# EAGLE design p2c-001 (EAGLE 9.6.2)
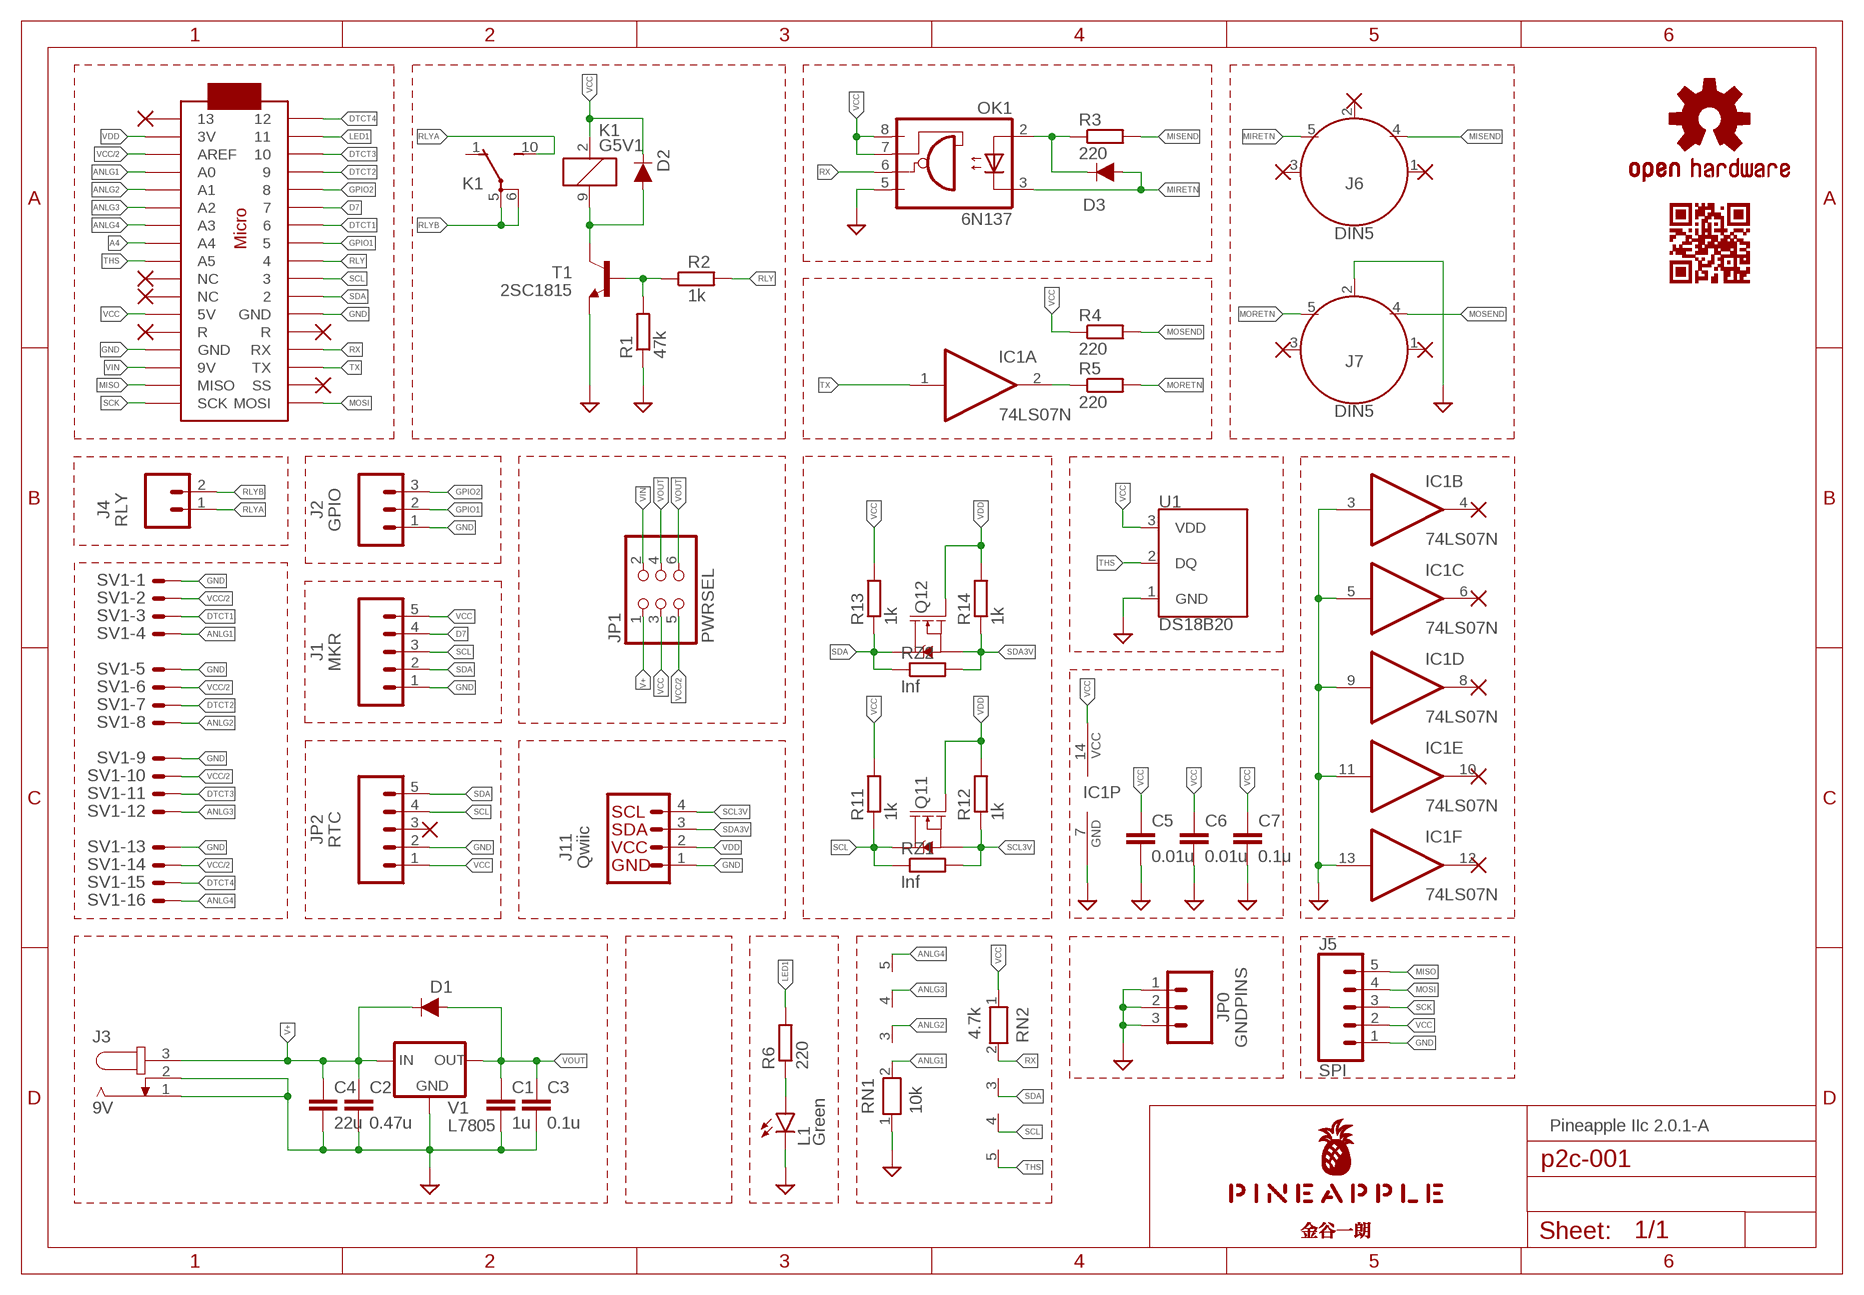
[diagram p0: schematic, sheet 1]

## Parts
C1  1u  C-EU050-024X044  [C050-024X044]
C2  0.47u  C-EU050-024X044  [C050-024X044]
C3  0.1u  C-EU025-024X044  [C025-024X044]
C4  22u  C-EU025-050X050  [C025-050X050]
C5  0.01u  C-EU025-024X044  [C025-024X044]
C6  0.01u  C-EU025-024X044  [C025-024X044]
C7  0.1u  C-EU025-024X044  [C025-024X044]
D1  DIODE-1N4148  [DIODE-1N4148]
D2  DIODE-1N4148  [DIODE-1N4148]
D3  DIODE-1N4148  [DIODE-1N4148]
IC1  74LS07N  [DIL14]
J1  MKR  CONN_05JST  [JST-5-PTH]
J2  GPIO  CONN_03JST-PTH  [JST-3-PTH]
J3  9V  JACK-PLUG0  [SPC4077]
J4  RLY  CONN_02JST-PTH-2  [JST-2-PTH]
J5  SPI  CONN_05JST-VERT  [JST-5-PTH-VERT]
J6  DIN5  [DIN5-RA-PTH]
J7  DIN5  [DIN5-RA-PTH]
J11  Qwiic  QWIIC_CONNECTORJS-1MM  [1X04_1MM_RA]
JP0  GNDPINS  CONN_03  [1X03]
JP1  PWRSEL  PINHD-2X3  [2X03]
JP2  RTC  CONN_05  [1X05]
K1  G5V1  [G5V1]
L1  Green  LED3MM  [LED3MM]
LOGO1  OSHW-LOGOS-COPPER  [OSHW-LOGO-S_COPPER]
OK1  6N137  [DIL08]
Q11  220mA/50V/3.5Ω  MOSFET-NCH-BSS138  [SOT23-3]
Q12  220mA/50V/3.5Ω  MOSFET-NCH-BSS138  [SOT23-3]
R1  47k  R-EU_0204/5  [0204/5]
R2  1k  R-EU_0204/5  [0204/5]
R3  220  R-EU_0204/5  [0204/5]
R4  220  R-EU_0204/5  [0204/5]
R5  220  R-EU_0204/5  [0204/5]
R6  220  R-EU_0204/5  [0204/5]
R11  1k  R-EU_R2012  [R2012]
R12  1k  R-EU_R2012  [R2012]
R13  1k  R-EU_R2012  [R2012]
R14  1k  R-EU_R2012  [R2012]
RN1  10k  RN04  [RN-5]
RN2  4.7k  RN04  [RN-5]
RZ1  Inf  R-EU_R2012  [R2012]
RZ2  Inf  R-EU_R2012  [R2012]
SV1  ML16LE  [ML16L]
T1  2SC1815  [TO92-ECB]
U1  DS18B20  [TO-92-AMMO]
U$1  PINEAPPLE450_SILK  [PINEAPPLE450_SILK]
U$2  ARDUINOMICRO  [ARDUINOMICRO]
U$3  KANAYA768_SILK  [KANAYA768_SILK]
U$4  CARDQRCODE450_SILK  [CARDQRCODE450_SILK]
V1  L7805  78XXS  [78XXS]

## Nets
A4: U$2.P$27(A4)
ANLG1: RN1.2 SV1.4 U$2.P$31(A0)
ANLG2: RN1.3 SV1.8 U$2.P$30(A1)
ANLG3: RN1.4 SV1.12 U$2.P$29(A2)
ANLG4: RN1.5 SV1.16 U$2.P$28(A3)
D7: J1.4 U$2.P$6
DTCT1: SV1.3 U$2.P$7
DTCT2: SV1.7 U$2.P$4
DTCT3: SV1.11 U$2.P$3
DTCT4: SV1.15 U$2.P$1
GND [ground]: C1.2 C2.2 C3.2 C4.2 C5.2 C6.2 C7.2 IC1.3(B:I) IC1.5(C:I) IC1.7(P:GND) IC1.9(D:I) IC1.11(E:I) IC1.13(F:I) J1.1 J2.1 J3.1 J3.2 J5.1 J7.2 J11.1(GND) JP0.1 JP0.2 JP0.3 JP2.2 L1.K(C) OK1.5(GND) R1.1 RN1.1 SV1.1 SV1.5 SV1.9 SV1.13 T1.E U1.1(GND) U$2.P$12(GND) U$2.P$21(GND) V1.GND
GPIO1: J2.2 U$2.P$8
GPIO2: J2.3 U$2.P$5
LED1: R6.2 U$2.P$2
LED1A: L1.A R6.1
MIA: D3.C OK1.2(A) R3.1
MIRETN: D3.A J6.5 OK1.3(C)
MISEND: J6.4 R3.2
MISO: J5.5 U$2.P$19(MISO)
MOC: IC1.2(A:O) R5.1
MORETN: J7.5 R5.2
MOSEND: J7.4 R4.2
MOSI: J5.4 U$2.P$17(MOSI)
RLY: R2.2 U$2.P$9
RLYA: J4.1 K1.10(2:S)
RLYB: J4.2 K1.5(2:P) K1.6(2:P)
RLYC: D2.A K1.9 T1.C
RLYQ: R1.2 R2.1 T1.B
RX: OK1.6(VO) RN2.2 U$2.P$14(RX)
SCK: J5.3 U$2.P$18(SCK)
SCL: J1.3 JP2.4 Q11.3(D) R11.1 RN2.4 RZ1.1 U$2.P$10
SCL3V: J11.4(SCL) Q11.2(S) R12.1 RZ1.2
SDA: J1.2 JP2.5 Q12.3(D) R13.1 RN2.3 RZ2.1 U$2.P$11
SDA3V: J11.3(SDA) Q12.2(S) R14.1 RZ2.2
THS: RN2.5 U1.2(DQ) U$2.P$26(A5)
TX: IC1.1(A:I) U$2.P$15(TX)
V+ [power1]: C2.1 C4.1 D1.C J3.3 JP1.1 V1.IN
VCC [power1]: C5.1 C6.1 C7.1 D2.C IC1.14(P:VCC) J1.5 J5.2 JP1.3 JP2.1 K1.2 OK1.7(VE) OK1.8(VCC) R4.1 R11.2 R13.2 RN2.1 U1.3(VDD) U$2.P$23(5V)
VCC/2 [power1]: JP1.5 SV1.2 SV1.6 SV1.10 SV1.14 U$2.P$32(AREF)
VDD [power2]: J11.2(VCC) Q11.1(G) Q12.1(G) R12.2 R14.2 U$2.P$33(3V)
VIN [power1]: JP1.2 U$2.P$20(9V)
VOUT [power1]: C1.1 C3.1 D1.A JP1.4 JP1.6 V1.OUT
Unconnected: IC1.4(B:O) IC1.6(C:O) IC1.8(D:O) IC1.10(E:O) IC1.12(F:O) J6.1 J6.2 J6.3 J7.1 J7.3 JP2.3 K1.1(2:O) U$2.P$13(R) U$2.P$16(SS) U$2.P$22(R) U$2.P$24(NC) U$2.P$25(NC) U$2.P$34

## Notes on the sheet
- Pineapple IIc 2.0.1-A

## Library data of the parts
C1-C4 C7 = rcl:C-EU: CAPACITOR, European symbol; SPICEPREFIX: C
C5 C6 = resistor:C-EU: CAPACITOR, European symbol
D1-D3 = SparkFun-DiscreteSemi:DIODE: Diode These are standard reverse protection diodes and small signal diodes. SparkFun Products: SparkFun SparkPunk Sound Kit <https://www.sparkfun.com/products/11177> SparkFun ESP8266 Thing <https://www.sparkfun.com/products/13231>; PROD_ID: DIO-08378; VALUE: 200mA/100V/1V
IC1 = 74xx-us:74*07: Hex BUFFER, open collector high-voltage output
J1 = SparkFun-Connectors:CONN_05: Multi connection point. Often used as Generic Header-pin footprint for 0.1 inch spaced/style header connections On any of the 0.1 inch spaced packages, you can populate with these: Break Away Headers - Straight <https://www.sparkfun.com/products/116> (PRT-00116) Break Away Male Headers - Right Angle <https://www.sparkfun.com/products/553> (PRT-00553) Female Headers <https://www.sparkfun.com/products/115> (PRT-00115) Break Away Headers - Machine Pin <https://www.sparkfun.com/products/117> (PRT-00117) Break Away Female Headers - Swiss Machine Pin <https://www.sparkfun.com/products/743> (PRT-00743) For SCREWTERMINALS and SPRING TERMINALS visit here: Screw Terimnals on SparkFun.com <https://www.sparkfun.com/search/results?term=Screw+Terminals> (5mm/3.5mm/2.54mm spacing) This device is also useful as a general connection point to wire up your design to another part of your project. Our various solder wires solder well into these plated through hole pads. Hook-Up Wire - Assortment (Stranded, 22 AWG) <https://www.sparkfun.com/products/11375> (PRT-11375) Hook-Up Wire - Assortment (Solid Core, 22 AWG) <https://www.sparkfun.com/products/11367> (PRT-11367) View the entire wire category on our website here <https://www.sparkfun.com/categories/141> Special notes: Molex polarized connector foot print use with SKU : PRT-08231 with associated crimp pins and housings. 1MM SMD Version SKU: PRT-10208; SF_ID: PRT-09917
J2 = SparkFun-Connectors:CONN_03: Multi connection point. Often used as Generic Header-pin footprint for 0.1 inch spaced/style header connections On any of the 0.1 inch spaced packages, you can populate with these: Break Away Headers - Straight <https://www.sparkfun.com/products/116> (PRT-00116) Break Away Male Headers - Right Angle <https://www.sparkfun.com/products/553> (PRT-00553) Female Headers <https://www.sparkfun.com/products/115> (PRT-00115) Break Away Headers - Machine Pin <https://www.sparkfun.com/products/117> (PRT-00117) Break Away Female Headers - Swiss Machine Pin <https://www.sparkfun.com/products/743> (PRT-00743) Stackable Header - 3 Pin (Female, 0.1") <https://www.sparkfun.com/products/13875> (PRT-13875) For SCREWTERMINALS and SPRING TERMINALS visit here: Screw Terimnals on SparkFun.com <https://www.sparkfun.com/search/results?term=Screw+Terminals> (5mm/3.5mm/2.54mm spacing) This device is also useful as a general connection point to wire up your design to another part of your project. Our various solder wires solder well into these plated through hole pads. Hook-Up Wire - Assortment (Stranded, 22 AWG) <https://www.sparkfun.com/products/11375> (PRT-11375) Hook-Up Wire - Assortment (Solid Core, 22 AWG) <https://www.sparkfun.com/products/11367> (PRT-11367) View the entire wire category on our website here <https://www.sparkfun.com/categories/141> Special notes: Molex polarized connector foot print use with SKU : PRT-08232 with associated crimp pins and housings.; PROD_ID: WIRE-10037; SF_ID: PRT-09915
J3 = con-jack:JACK-PLUG: DC POWER JACK Power Jack, DC, Right Angle, Through Hole, Rated 5A at 16VDC, PC Terminals Distributor: Farnell (www.Farnell.de) Drawing: 84N1161.pdf / 84N1162.pdf Manufacturer: SPC Technology (www.spctechnology.com) Type: SPC4077 / SPC 4078; OC_FARNELL: unknown; OC_NEWARK: unknown
J4 = SparkFun-Connectors:CONN_02: Multi connection point. Often used as Generic Header-pin footprint for 0.1 inch spaced/style header connections On any of the 0.1 inch spaced packages, you can populate with these: Break Away Headers - Straight <https://www.sparkfun.com/products/116> (PRT-00116) Break Away Male Headers - Right Angle <https://www.sparkfun.com/products/553> (PRT-00553) Female Headers <https://www.sparkfun.com/products/115> (PRT-00115) Break Away Headers - Machine Pin <https://www.sparkfun.com/products/117> (PRT-00117) Break Away Female Headers - Swiss Machine Pin <https://www.sparkfun.com/products/743> (PRT-00743) For SCREWTERMINALS and SPRING TERMINALS visit here: Screw Terimnals on SparkFun.com <https://www.sparkfun.com/search/results?term=Screw+Terminals> (5mm/3.5mm/2.54mm spacing) This device is also useful as a general connection point to wire up your design to another part of your project. Our various solder wires solder well into these plated through hole pads. Hook-Up Wire - Assortment (Stranded, 22 AWG) <https://www.sparkfun.com/products/11375> (PRT-11375) Hook-Up Wire - Assortment (Solid Core, 22 AWG) <https://www.sparkfun.com/products/11367> (PRT-11367) View the entire wire category on our website here <https://www.sparkfun.com/categories/141> Special notes: Molex polarized connector foot print use with: PRT-08233 with associated crimp pins and housings. 2.54_SCREWTERM for use with PRT-10571. 3.5mm Screw Terminal footprints for PRT-08084 5mm Screw Terminal footprints for use with PRT-08432; PROD_ID: CONN-09863; SKU: PRT-09914
J5 JP2 = SparkFun-Connectors:CONN_05: Multi connection point. Often used as Generic Header-pin footprint for 0.1 inch spaced/style header connections On any of the 0.1 inch spaced packages, you can populate with these: Break Away Headers - Straight <https://www.sparkfun.com/products/116> (PRT-00116) Break Away Male Headers - Right Angle <https://www.sparkfun.com/products/553> (PRT-00553) Female Headers <https://www.sparkfun.com/products/115> (PRT-00115) Break Away Headers - Machine Pin <https://www.sparkfun.com/products/117> (PRT-00117) Break Away Female Headers - Swiss Machine Pin <https://www.sparkfun.com/products/743> (PRT-00743) For SCREWTERMINALS and SPRING TERMINALS visit here: Screw Terimnals on SparkFun.com <https://www.sparkfun.com/search/results?term=Screw+Terminals> (5mm/3.5mm/2.54mm spacing) This device is also useful as a general connection point to wire up your design to another part of your project. Our various solder wires solder well into these plated through hole pads. Hook-Up Wire - Assortment (Stranded, 22 AWG) <https://www.sparkfun.com/products/11375> (PRT-11375) Hook-Up Wire - Assortment (Solid Core, 22 AWG) <https://www.sparkfun.com/products/11367> (PRT-11367) View the entire wire category on our website here <https://www.sparkfun.com/categories/141> Special notes: Molex polarized connector foot print use with SKU : PRT-08231 with associated crimp pins and housings. 1MM SMD Version SKU: PRT-10208
J6 J7 = SparkFun-Connectors:DIN5: DIN5 Connector - Female Right Angle (frequently used as a MIDI Jack connector) This type of connector and cable is frequently used for transmitting midi data (musical instrument digital interface). It is what you usually see on a keyboard or set of electronic drums. Learn more here <https://en.wikipedia.org/wiki/MIDI>. For more information on the pinout and electrical specifications of MIDI communications, please see the following resource: https://www.midi.org/specifications/item/midi-din-electrical-specification Here is the connector we sell at SparkFun: MIDI Connector - Female Right Angle <https://www.sparkfun.com/products/9536> (PRT-09536) Datasheet <hhttp://www.sparkfun.com/datasheets/Prototyping/Connectors/MIDI-RA.pdf> It is used on this SparkFun product: SparkFun MIDI Shield <https://www.sparkfun.com/products/12898> (DEV-12898); PROD_ID: CONN-09481
J11 = SparkFun-Connectors:QWIIC_CONNECTOR: SparkFun I2C Standard Qwiic Connector An SMD 1mm pitch JST connector makes it easy and quick (get it? Qwiic?) to connect I2C devices to each other. The Qwiic system <http://www.sparkfun.com/qwiic> enables fast and solderless connection between popular platforms and various sensors and actuators. We carry 200mm <https://www.sparkfun.com/products/14204>, 100mm <https://www.sparkfun.com/products/14205>, 50mm <https://www.sparkfun.com/products/14206>, and breadboard friendly <https://www.sparkfun.com/products/14207> Qwiic cables. We also offer 10 pcs strips <https://www.sparkfun.com/products/14323> the SMD connectors.
JP0 = SparkFun-Connectors:CONN_03: Multi connection point. Often used as Generic Header-pin footprint for 0.1 inch spaced/style header connections On any of the 0.1 inch spaced packages, you can populate with these: Break Away Headers - Straight <https://www.sparkfun.com/products/116> (PRT-00116) Break Away Male Headers - Right Angle <https://www.sparkfun.com/products/553> (PRT-00553) Female Headers <https://www.sparkfun.com/products/115> (PRT-00115) Break Away Headers - Machine Pin <https://www.sparkfun.com/products/117> (PRT-00117) Break Away Female Headers - Swiss Machine Pin <https://www.sparkfun.com/products/743> (PRT-00743) Stackable Header - 3 Pin (Female, 0.1") <https://www.sparkfun.com/products/13875> (PRT-13875) For SCREWTERMINALS and SPRING TERMINALS visit here: Screw Terimnals on SparkFun.com <https://www.sparkfun.com/search/results?term=Screw+Terminals> (5mm/3.5mm/2.54mm spacing) This device is also useful as a general connection point to wire up your design to another part of your project. Our various solder wires solder well into these plated through hole pads. Hook-Up Wire - Assortment (Stranded, 22 AWG) <https://www.sparkfun.com/products/11375> (PRT-11375) Hook-Up Wire - Assortment (Solid Core, 22 AWG) <https://www.sparkfun.com/products/11367> (PRT-11367) View the entire wire category on our website here <https://www.sparkfun.com/categories/141> Special notes: Molex polarized connector foot print use with SKU : PRT-08232 with associated crimp pins and housings.
JP1 = pinhead:PINHD-2X3: PIN HEADER
K1 = relay:G5V1: RELAY 1 x switch, 0.5 A/125 V AC, 1 A/24 V DC , Omron; MPN: G5V-1-DC24; OC_FARNELL: 9949593; OC_NEWARK: 36M6377
L1 = led:LED: LED OSRAM: - CHIPLED LG R971, LG N971, LY N971, LG Q971, LY Q971, LO R971, LY R971 LH N974, LH R974 LS Q976, LO Q976, LY Q976 LO Q996 - Hyper CHIPLED LW Q18S LB Q993, LB Q99A, LB R99A - SideLED LS A670, LO A670, LY A670, LG A670, LP A670 LB A673, LV A673, LT A673, LW A673 LH A674 LY A675 LS A676, LA A676, LO A676, LY A676, LW A676 LS A679, LY A679, LG A679 - Hyper Micro SIDELED® LS Y876, LA Y876, LO Y876, LY Y876 LT Y87S - SmartLED LW L88C, LW L88S LB L89C, LB L89S, LG L890 LS L89K, LO L89K, LY L89K LS L896, LA L896, LO L896, LY L896 - TOPLED LS T670, LO T670, LY T670, LG T670, LP T670 LSG T670, LSP T670, LSY T670, LOP T670, LYG T670 LG T671, LOG T671, LSG T671 LB T673, LV T673, LT T673, LW T673 LH T674 LS T676, LA T676, LO T676, LY T676, LB T676, LH T676, LSB T676, LW T676 LB T67C, LV T67C, LT T67C, LS T67K, LO T67K, LY T67K, LW E67C LS E67B, LA E67B, LO E67B, LY E67B, LB E67C, LV E67C, LT E67C LW T67C LS T679, LY T679, LG T679 LS T770, LO T770, LY T770, LG T770, LP T770 LB T773, LV T773, LT T773, LW T773 LH T774 LS E675, LA E675, LY E675, LS T675 LS T776, LA T776, LO T776, LY T776, LB T776 LHGB T686 LT T68C, LB T68C - Hyper Mini TOPLED® LB M676 - Mini TOPLED Santana® LG M470 LS M47K, LO M47K, LY M47K Source: http://www.osram.convergy.de LUXEON: - LUMILED® LXK2-PW12-R00, LXK2-PW12-S00, LXK2-PW14-U00, LXK2-PW14-V00 LXK2-PM12-R00, LXK2-PM12-S00, LXK2-PM14-U00 LXK2-PE12-Q00, LXK2-PE12-R00, LXK2-PE12-S00, LXK2-PE14-T00, LXK2-PE14-U00 LXK2-PB12-K00, LXK2-PB12-L00, LXK2-PB12-M00, LXK2-PB14-N00, LXK2-PB14-P00, LXK2-PB14-Q00 LXK2-PR12-L00, LXK2-PR12-M00, LXK2-PR14-Q00, LXK2-PR14-R00 LXK2-PD12-Q00, LXK2-PD12-R00, LXK2-PD12-S00 LXK2-PH12-R00, LXK2-PH12-S00 LXK2-PL12-P00, LXK2-PL12-Q00, LXK2-PL12-R00 Source: www.luxeon.com KINGBRIGHT: KA-3528ASYC Source: www.kingbright.com
LOGO1 = SparkFun-Aesthetics:OSHW-LOGO: Open-Source Hardware (OSHW) Logo This logo indicates the piece of hardware it is found on incorporates a OSHW license and/or adheres to the definition of open source hardware found here: http://freedomdefined.org/OSHW
OK1 = optocoupler:6N137: MOTOROLA OPTO COUPLER; MPN: 6N137; OC_FARNELL: 1328376; OC_NEWARK: 52M1895
Q11 Q12 = SparkFun-DiscreteSemi:MOSFET-NCH: N-channel MOSFETs Voltage controlled devices that allow control of high current outputs. SparkFun Products: SparkFun OpenScale <https://www.sparkfun.com/products/13261> SparkFun Digital Sandbox <https://www.sparkfun.com/products/12651> SparkFun Monster Moto Shield <https://www.sparkfun.com/products/10182> SparkFun MOSFET Power Controller <https://www.sparkfun.com/products/11214>; PROD_ID: TRANS-00830
R1-R6 R11-R14 RZ1 RZ2 = resistor:R-EU_: RESISTOR, European symbol
RN1 RN2 = resistor-net:RN04: RESISTOR NETWORK; OC_FARNELL: unknown; OC_NEWARK: unknown
SV1 = con-ml:ML16LE: HARTING; OC_FARNELL: unknown; OC_NEWARK: unknown
T1 = transistor:2SC1815: NPN EPITAXIAL TRANSISTOR Source: TOSHIBA .. 2SC1815 1.pdf
U1 = SparkFun-Sensors:DS18B20: Dallas/Maxim DS18B20 1-Wire Temperature Sensor The DS18B20 reports degrees C with 9 to 12-bit precision, -55C to 125C (+/-0.5C). Each sensor has a unique 64-Bit Serial number etched into it - allows for a huge number of sensors to be used on one data bus. Datasheet <http://datasheets.maximintegrated.com/en/ds/DS18B20.pdf> SparkFun Products One Wire Digital Temperature Sensor - DS18B20 <https://www.sparkfun.com/products/245> (SEN-00245); STORE_ID: SEN-00245
U$1 = pineapple:PINEAPPLE450_SILK
U$2 = adafruit:ARDUINOMICRO
U$3 = pineapple:KANAYA768_SILK
U$4 = pineapple:CARDQRCODE450_SILK
V1 = v-reg:78XXS: VOLTAGE REGULATOR

## Net classes
0 default: width 0.152 mm, drill 0.305 mm, clearance 0.152 mm
1 ground: width 0.61 mm, drill 0.305 mm, clearance 0.152 mm
2 power1: width 0.61 mm, drill 0.305 mm, clearance 0.152 mm
3 power2: width 0.305 mm, drill 0.305 mm, clearance 0.152 mm

## Board
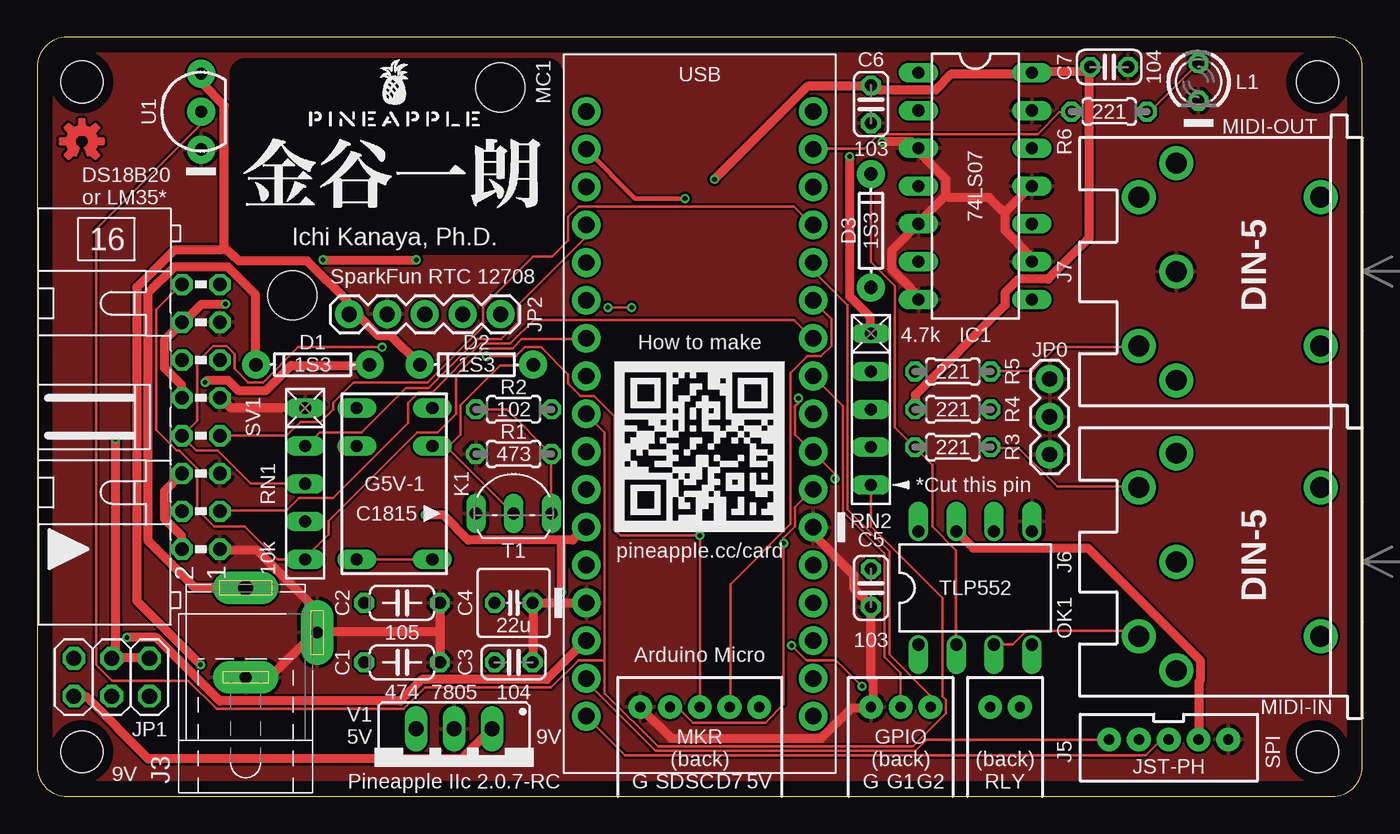
[diagram p1: board, top side]
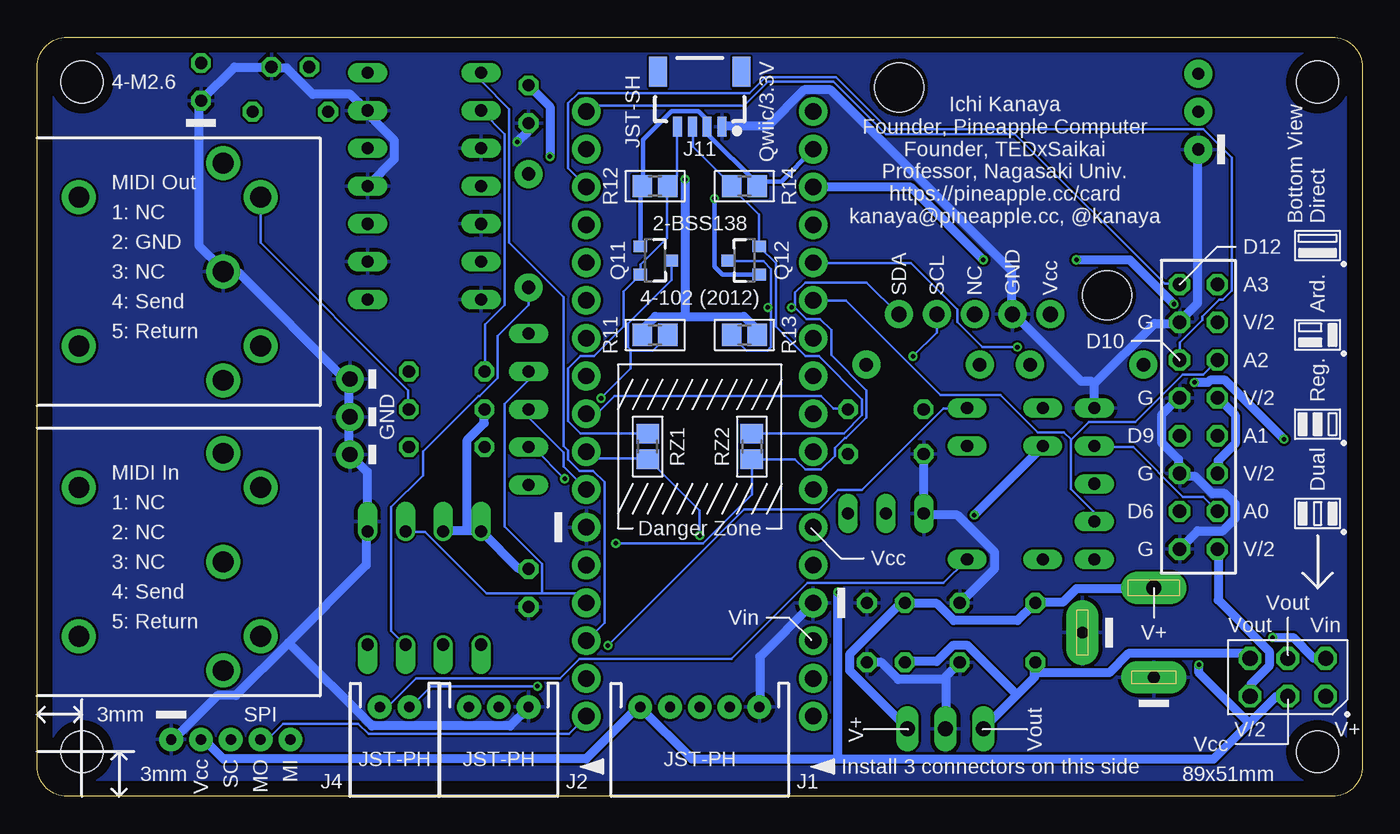
[diagram p2: board, bottom side, seen from below]

Size 89 x 51 mm. Coordinates in mm from the lower left corner, seen from the top.
Outline: 0,49 0,2 arc90 2,0 87,0 arc90 89,2 89,49 arc90 87,51 2,51 arc90 0,49
Copper layers (1*16): Top 0.035mm / dielectric 1.5mm / Bottom 0.035mm
Design rules "SeeedStudio_2layer_DRU_no_angle_20140221": minimum track width 6mil, minimum drill 12mil, track to track 6mil, track to pad 6mil, pad to pad 6mil, via to via 6mil, smd to smd 0mil, copper to edge 10mil, drill to drill 10mil, minimum pad ring 10mil, minimum via ring 6mil, stop-mask expansion 2mil, vias tented up to drill 100mil, thermal gap 10mil
Holes 2.8 mm at 3,3 3,48 86,48 86,3
tRestrict: area 0,0 to 89,1; area 88,0 to 89,51; area 0,50 to 89,51; area 0,0 to 1,51; area 1,46 to 5,50; area 1,1 to 5,5; area 84,1 to 88,5; area 84,46 to 88,50; area 13,36.5 to 35.2,49.5; area 39,18 to 50,29
bRestrict: area 0,0 to 89,1; area 88,0 to 89,51; area 0,50 to 89,51; area 0,0 to 1,51; area 84,46 to 88,50; area 84,1 to 88,5; area 1,46 to 5,50; area 1,1 to 5,5

### Footprints (pad centres in the part's own frame; a part is rotated, then mirrored left to right if it is on the bottom)
C050-024X044 = drill 0.813 octagon: 1 -2.54,0; 2 2.54,0
C025-024X044 = drill 0.813 octagon: 1 -1.27,0; 2 1.27,0
C025-050X050 = drill 0.813 octagon: 1 -1.27,0; 2 1.27,0
DIODE-1N4148 = drill 0.9 pad 1.88: A -3.81,0; C 3.81,0
DIL14 = drill 0.813 long: 1 -7.62,-3.81; 2 -5.08,-3.81; 3 -2.54,-3.81; 4 0,-3.81; 5 2.54,-3.81; 6 5.08,-3.81; 7 7.62,-3.81; 8 7.62,3.81; 9 5.08,3.81; 10 2.54,3.81; 11 0,3.81; 12 -2.54,3.81; 13 -5.08,3.81; 14 -7.62,3.81
JST-5-PTH = drill 0.7 pad 1.6: 1 -4,0; 2 -2,0; 3 0,0; 4 2,0; 5 4,0
JST-3-PTH = drill 0.7 pad 1.6: 1 -2,0; 2 0,0; 3 2,0
SPC4077 = drill 0.8 pad 2.184 long: 1 -3,0; 2 0,-4.8 | drill 1 pad 2.184 long: 3 3,0
JST-2-PTH = drill 0.7 pad 1.6: 1 -1,0; 2 1,0
JST-5-PTH-VERT = drill 0.7 pad 1.6: 1 -4,0.18; 2 -2,0.18; 3 0,0.18; 4 2,0.18; 5 4,0.18
DIN5-RA-PTH = drill 1.4 pad 2.286: 1 7.3,12.5; 2 0,12.5; 3 -7.3,12.5; 4 5,15; 5 -5,15; 6 -5,2.8; 7 5,2.8
1X04_1MM_RA = smd 0.6 x 1.35: 1 -1.5,0; 2 -0.5,0; 3 0.5,0; 4 1.5,0 | smd 1.2 x 2: NC1 2.8,-3.675; NC2 -2.8,-3.675
1X03 = drill 1.016 pad 1.88: 1 0,0; 2 2.54,0; 3 5.08,0
2X03 = drill 1.016 octagon: 1 -2.54,-1.27; 2 -2.54,1.27; 3 0,-1.27; 4 0,1.27; 5 2.54,-1.27; 6 2.54,1.27
1X05 = drill 1.016 pad 1.88: 1 0,0; 2 2.54,0; 3 5.08,0; 4 7.62,0; 5 10.16,0
G5V1 = drill 0.813 long: 1 -5.08,-2.54; 2 -2.54,-2.54; 5 5.08,-2.54; 6 5.08,2.54; 9 -2.54,2.54; 10 -5.08,2.54
LED3MM = drill 0.813 octagon: A -1.27,0; K 1.27,0
DIL08 = drill 0.813 offset: 1 -3.81,-3.81; 2 -1.27,-3.81; 3 1.27,-3.81; 4 3.81,-3.81; 5 3.81,3.81; 6 1.27,3.81; 7 -1.27,3.81; 8 -3.81,3.81
SOT23-3 = smd 0.8 x 0.9: 1 -0.95,-1; 2 0.95,-1; 3 0,1.1
0204/5 = drill 0.813 octagon: 1 -2.54,0; 2 2.54,0
R2012 = smd 1.3 x 1.5: 1 -0.85,0; 2 0.85,0
RN-5 = drill 0.813 long: 1 -5.08,0; 2 -2.54,0; 3 0,0; 4 2.54,0; 5 5.08,0
ML16L = drill 0.914 octagon: 1 -8.89,-1.27; 2 -8.89,1.27; 3 -6.35,-1.27; 4 -6.35,1.27; 5 -3.81,-1.27; 6 -3.81,1.27; 7 -1.27,-1.27; 8 -1.27,1.27; 9 1.27,-1.27; 10 1.27,1.27; 11 3.81,-1.27; 12 3.81,1.27; 13 6.35,-1.27; 14 6.35,1.27; 15 8.89,-1.27; 16 8.89,1.27
TO92-ECB = drill 0.813 long: B 2.54,0; C 0,0; E -2.54,0
TO-92-AMMO = drill 0.813 pad 1.88: 1 -2.54,0; 2 0,0; 3 2.54,0
ARDUINOMICRO = drill 1.1 pad 1.93: P$1 -20.32,7.62; P$2 -17.78,7.62; P$3 -15.24,7.62; P$4 -12.7,7.62; P$5 -10.16,7.62; P$6 -7.62,7.62; P$7 -5.08,7.62; P$8 -2.54,7.62; P$9 0,7.62; P$10 2.54,7.62; P$11 5.08,7.62; P$12 12.7,-7.62; P$13 10.16,-7.62; P$14 12.7,7.62; P$15 15.24,7.62; P$16 17.78,7.62; P$17 20.32,7.62; P$18 20.32,-7.62; P$19 17.78,-7.62; P$20 15.24,-7.62; P$21 7.62,7.62; P$22 10.16,7.62; P$23 7.62,-7.62; P$24 5.08,-7.62; P$25 2.54,-7.62; P$26 0,-7.62; P$27 -2.54,-7.62; P$28 -5.08,-7.62; P$29 -7.62,-7.62; P$30 -10.16,-7.62; P$31 -12.7,-7.62; P$32 -15.24,-7.62; P$33 -17.78,-7.62; P$34 -20.32,-7.62
STAND-OFF = hole 3.302: 0,0
78XXS = drill 1.016 long: GND 0,-2.54; IN -2.54,-2.54; OUT 2.54,-2.54

### Placement (x,y rotation side)
C1  24.5,9 0 top
C2  24.5,13 0 top
C3  32,9 0 top
C4  32,13 0 top
C5  56,14 270 top
C6  56,46.5 270 top
C7  72,49 0 top
D1  18.5,29 180 top
D2  29.5,29 180 top
D3  56,38 90 top
IC1  63,41 270 top
J1  44.5,6 180 bottom
J2  58,6 180 bottom
J3  14,11 90 top
J4  65,6 180 bottom
J5  76,4 180 top
J6  89,15.75 90 top
J7  89,35.25 90 top
J11  44.5,45 180 bottom
JP0  68,22.96 90 top
JP1  5,8 0 top
JP2  20.95,32.38 0 top
K1  24,21 270 top
L1  78,48 270 top
LOGO1  3,44 0 top
OK1  63,14 0 top
Q11  47.5,36 270 bottom
Q12  41.5,36 90 bottom
R1  32,23 0 top
R2  32,26 0 top
R3  61.5,23.46 0 top
R4  61.5,26 0 top
R5  61.5,28.54 0 top
R6  72,46 180 top
R11  47.5,31 180 bottom
R12  47.5,41 180 bottom
R13  41.5,31 0 bottom
R14  41.5,41 0 bottom
RN1  18,21 270 top
RN2  56,26 270 top
RZ1  48,23.5 90 bottom
RZ2  41,23.5 90 bottom
SV1  11,25.5 90 top
T1  32,19 0 top
U1  11,46 90 top
U$1  24,45 0 top
U$2  44.5,25.7 270 top
U$3  24,39.5 0 top
U$4  44.5,23.5 0 top
U$5  [STAND-OFF]  17.14,33.66 0 top
U$6  [STAND-OFF]  31.11,47.62 0 top
V1  28,2 180 top

### Tracks (layer width: path | path; a pad name or v marks a point on that pad's centre or on a via)
ANLG1
  Top 0.152: U$2.P$31 36.8,38.33 36.8,37.49 32.31,32.99 32.31,31.85 31.17,30.71 29.57,30.71 26.29,27.43 24.77,27.43 21.79,24.46 18.97,24.46 18.06,23.55 RN1.2
  Bottom 0.152: RN1.2 17.98,23.47 15.39,23.47 12.04,20.12 10.67,20.12 9.75,19.2 SV1.4
ANLG2  (via drill 0.3)
  Top 0.152: RN1.3 17.98,21.03 14.33,21.03 12.12,23.24 10.67,23.24 9.75,24.16 SV1.8 9.75,24.23 10.74,25.22 10.74,29.18 11.81,30.25 12.72,30.25 13.26,29.72 13.26,28.73 14.17,27.81 15.16,27.81 17.53,30.18 v23.16,30.18
  Bottom 0.152: v23.16,30.18 25.53,30.18 27.2,31.85 27.2,32.69 30.33,35.81 36.8,35.81 U$2.P$30
ANLG3
  Bottom 0.152: 19.55,23.96 18.36,25.15 15.24,25.15 12.04,28.35 10.67,28.35 9.75,29.26 SV1.12 | 19.55,23.96 19.58,23.93 19.58,20.65 18.06,19.13 18.06,18.52 RN1.4 | 19.55,23.96 20.04,24.46 21.79,24.46 24.31,26.98 28.35,26.98 34.67,33.3 36.8,33.3 U$2.P$29
ANLG4
  Top 0.152: SV1.16 9.68,34.37 8,32.69 8,24.61 9.37,23.24 9.53,23.24 10.74,22.02 10.74,19.28 11.89,18.14 13.95,18.14 16.15,15.93 17.98,15.93 RN1.5 17.98,16 19.58,17.6 19.58,18.52 25.53,24.46 26.9,24.46 28.12,25.68 28.12,28.27 29.95,30.1 31.93,30.1 32.54,30.71 36.8,30.71 U$2.P$28
D7
  Top 0.152: J1.4 46.56,6.02 46.56,14.25 50.6,18.29 50.6,28.42 51.74,29.57 52.65,29.57 53.34,30.25 53.34,32.08 52.12,33.3 U$2.P$6
DTCT1
  Top 0.152: SV1.3 12.34,19.2 16.76,19.2 17.6,20.04 19.89,20.04 24.92,25.07 24.92,26.44 25.6,27.13 26.52,27.13 29.79,30.4 31.77,30.4 33.38,32 50.83,32 52.05,30.79 U$2.P$7
DTCT2
  Top 0.152: SV1.7 12.34,24.23 16.76,24.23 17.68,25.15 19.05,25.15 19.89,25.98 19.89,26.44 21.26,27.81 26.21,27.81 29.95,31.55 29.95,32.92 33.3,36.27 34.59,36.27 35.66,37.34 35.66,38.94 36.35,39.62 50.83,39.62 52.05,38.41 U$2.P$4
DTCT3
  Bottom 0.152: SV1.11 12.27,29.34 12.27,30.48 10.74,32 10.74,32.23 9.6,33.38 9.37,33.38 8.76,33.98 8.76,42.9 10.67,44.81 31.85,44.81 35.36,48.31 40.08,48.31 41.15,47.24 52.65,47.24 53.34,46.56 53.34,42.22 52.12,41 U$2.P$3
DTCT4
  Bottom 0.152: SV1.15 12.34,34.44 13.26,34.44 23.32,44.5 32,44.5 35.51,48.01 39.93,48.01 41.53,46.41 51.66,46.41 52.05,46.02 U$2.P$1
GND  (via drill 0.3)
  Top 0.61: IC1.7 59.13,33.45 59.13,33.68 57.38,35.43 57.38,36.65 59.13,38.41 IC1.5 59.36,38.71 61.04,40.39 | 61.04,40.39 61.04,41.45 59.21,43.28 59.21,43.51 IC1.3 58.98,43.74 58.75,43.97 v56.77,43.97 | 65,39.24 65,38.02 66.75,36.27 66.75,35.97 IC1.9 | 65,39.24 66.75,41 IC1.11 | 61.04,40.39 61.27,40.23 63.93,40.23 64.77,39.4 65,39.24 | RN1.1 17.98,26.14 12.95,26.14 12.34,26.75 SV1.9 | U$2.P$21 52.12,18.06 52.12,17.6 54.86,14.86 54.86,13.95 55.85,12.95 C5.2 56.01,7.92 56.16,7.77 56.16,6.17 56.01,6.02 J2.1 55.7,5.94 54.71,5.94 52.65,3.89 42.6,3.89 40.54,5.94 J1.1 | SV1.1 12.34,16.54 14.78,16.54 18.75,12.57 18.75,11.05 J3.2 | J3.1 14.02,8 15.62,8 18.52,10.9 J3.2 | C3.2 33.3,9.07 33.3,12.95 C4.2 33.6,12.95 36.8,12.95 U$2.P$12 | 27.05,11.05 27.05,12.95 C2.2 | 27.05,11.05 27.05,9.07 C1.2 | 27.05,11.05 19.05,11.05 J3.2
  Bottom 0.61: v56.77,43.97 56.01,44.73 56.01,45.19 C6.2 | IC1.11 66.75,41.07 65,42.82 65,44.04 66.75,45.8 66.75,46.02 IC1.13 67.06,46.25 67.97,47.17 70.48,47.17 72.24,48.92 73,48.92 C7.2 73.3,49 75.74,49 77.95,46.79 L1.K 78.11,46.48 78.11,36.96 76.66,35.51 J7.2 76.43,35.2 75.51,35.2 68.35,28.04 JP0.3 68.05,27.96 68.05,25.76 JP0.2 68.05,25.45 68.05,23.24 JP0.1 67.97,22.94 66.83,21.79 66.83,17.83 OK1.5 66.9,17.53 66.9,15.54 72.12,10.32 | 72.12,10.32 75.67,6.78 76.89,6.78 79.78,3.89 79.93,3.89 J5.1 | SV1.9 12.34,26.75 13.49,25.6 13.49,23.77 12.34,22.63 12.34,21.72 SV1.5 12.04,21.49 11.2,21.49 10.06,20.34 9.22,20.34 8.53,19.66 8.53,18.67 9.37,17.83 11.05,17.83 SV1.1 | 17.98,27.74 13.95,31.77 12.34,31.77 SV1.13 12.12,32.08 11.05,33.15 11.05,43.43 U1.1 | 17.98,27.74 17.98,26.14 RN1.1 | J11.1 42.98,45.03 39.93,45.03 37.49,47.47 35.74,47.47 23.55,35.28 23.55,32.38 JP2.2 23.24,32.23 18.9,27.89 18.21,27.89 17.98,27.74 | J1.1 40.46,6.02 40.46,9.37 36.88,12.95 U$2.P$12 | R1.1 29.49,22.94 29.49,19.05 T1.E 29.18,18.9 27.2,18.9 24.69,16.38 24.69,15.32 26.98,13.03 C2.2 | 27.96,7.85 27.96,8.08 C1.2 | 27.96,7.85 27.96,4.57 V1.GND | 27.96,7.85 31.17,7.85 32.31,8.99 33.22,8.99 C3.2 | 72.12,10.32 66.52,4.72 57.23,4.72 56.01,5.94 J2.1
  pour Top: -0.5,-0.5 89.5,-0.5 89.5,51.5 -0.5,51.5
  pour Bottom: -1,-1 90,-1 90,52 -1,52
GPIO1
  Top 0.152: J2.2 57.99,6.02 57.99,8.31 56.92,9.37 56.92,16.31 54.1,19.13 54.1,26.21 52.12,28.19 U$2.P$8
GPIO2
  Top 0.152: J2.3 59.97,6.02 59.97,6.78 57.23,9.53 57.23,16.46 54.41,19.28 54.41,32.99 52.12,35.28 52.12,35.81 U$2.P$5
LED1
  Top 0.152: R6.2 69.42,45.95 68.66,45.95 67.21,44.5 56.54,44.5 55.55,43.51 52.12,43.51 U$2.P$2
LED1A
  Top 0.152: R6.1 74.6,46.02 74.75,46.02 77.95,49.23 L1.A
MIA
  Top 0.152: OK1.2 61.72,10.21 61.72,16.54 60.12,18.14 60.12,22.25 58.98,23.39 R3.1 58.9,23.47 57.61,24.77 57.61,34.29 56.01,35.89 56.01,41.76 D3.C
MIRETN
  Top 0.152: OK1.3 64.31,10.21 65.53,10.21 66.45,11.12 73.69,11.12 73.99,10.82 J6.5
  Bottom 0.152: D3.A 56.01,34.14 56.01,32.99 58.06,30.94 58.06,28.12 59.28,26.9 59.36,26.9 63.09,23.16 63.09,21.57 65.23,19.43 65.23,11.12 64.31,10.21 OK1.3
MISEND
  Top 0.152: R3.2 64.08,23.39 65.91,23.39 68.5,20.8 73.99,20.8 J6.4
MISO
  Top 0.152: J5.5 71.93,3.81 59.74,3.81 58.98,3.05 41.53,3.05 36.88,7.7 36.88,7.85 U$2.P$19
MOC
  Bottom 0.152: R5.1 58.9,28.57 58.9,31.7 57.61,32.99 57.61,44.5 59.13,46.02 IC1.2
MORETN
  Top 0.152: R5.2 64.08,28.57 66.83,28.57 68.43,30.18 73.99,30.18 J7.5
MOSEND
  Bottom 0.152: R4.2 64.08,26.06 64.08,27.28 73.99,37.19 73.99,40.23 J7.4
MOSI
  Bottom 0.152: J5.4 73.99,3.89 73.46,3.89 72.47,4.88 67.44,4.88 66.75,4.19 53.26,4.19 52.12,5.33 U$2.P$17
RLY
  Bottom 0.152: R2.2 34.59,26.06 35.51,26.06 36.35,26.9 50.22,26.9 51.36,25.76 52.05,25.76 U$2.P$9
RLYA  (via drill 0.3)
  Top 0.152: v50.67,10.13 51.66,9.14 53.65,9.14 v55.4,7.39
  Bottom 0.152: v50.67,10.13 41.53,19.28 36.5,19.28 35.2,20.57 33.6,20.57 28.12,26.06 26.59,26.06 K1.10 | v55.4,7.39 62.56,7.39 63.93,6.02 J4.1
RLYB
  Top 0.152: K1.5 21.49,15.93 26.52,15.93 K1.6
  Bottom 0.152: J4.2 65.99,6.02 65.46,6.02 63.55,7.92 53.87,7.92 52.58,9.22 42.37,9.22 37.26,14.33 28.12,14.33 26.59,15.85 K1.6
RLYC
  Top 0.152: T1.C 31.93,19.05 27.51,23.47 26.59,23.47 K1.9 27.58,23.47 28.42,24.31 28.42,26.29 31.09,28.96 33.3,28.96 D2.A
RLYQ
  Top 0.152: R2.1 29.49,25.98 31.55,25.98 34.52,23.01 R1.2 34.52,22.94 34.52,19.05 T1.B
RX
  Bottom 0.152: 55.09,13.64 52.73,13.64 52.12,13.03 U$2.P$14 | 55.09,13.64 58.83,13.64 62.94,17.75 64.24,17.75 OK1.6 | 55.09,13.64 55.09,15.62 57.61,18.14 57.61,26.36 56.01,27.96 56.01,28.5 RN2.2
SCK
  Top 0.152: J5.3 75.97,3.81 75.51,3.81 74.45,2.74 39.47,2.74 36.88,5.33 U$2.P$18
SCL  (via drill 0.3)
  Top 0.152: v53.57,21.34 53.57,21.64 52.12,23.09 U$2.P$10 52.05,23.16 50.9,24.31 50.9,26.21 51.13,26.44 v51.13,26.75 | J1.3 44.5,6.02 v44.5,17.53 39.17,17.53 38.79,17.91 38.79,25.53 37.41,26.9 36.5,26.9 35.66,27.74 35.66,28.35 33.83,30.18 32.77,30.18 32.16,29.57 v30.18,29.57
  Bottom 0.152: 49.11,29.98 49.07,29.95 47.62,29.95 46.63,30.94 R11.1 | 49.11,29.98 49.3,30.18 49.3,31.77 46.41,34.67 46.41,35.97 Q11.3 | U$2.P$10 52.05,23.09 51.66,22.71 48.01,22.71 RZ1.1 47.93,22.63 44.5,19.2 v44.5,17.53 | v53.57,21.34 55.63,23.39 55.93,23.39 RN2.4 | v51.13,26.75 49.15,28.73 49.15,29.95 49.11,29.98 | JP2.4 28.57,31.17 v30.18,29.57
SCL3V
  Bottom 0.152: J11.4 46.02,44.96 46.02,41.68 46.63,41.07 R12.1 46.71,41 46.71,37.49 48.46,35.74 48.46,35.05 Q11.2 48.54,34.98 49.61,33.91 49.61,31.55 51.59,29.57 52.5,29.57 53.34,28.73 53.34,25.22 52.5,24.38 48.01,24.38 RZ1.2
SDA  (via drill 0.3)
  Top 0.152: v38.33,32.84 v39.93,32.84 | J1.2 42.52,5.94 43.05,5.94 44.04,4.95 48.92,4.95 50.14,6.17 v50.14,16.99 50.14,17.37 50.9,18.14 50.9,19.43 52.05,20.57 U$2.P$11
  Bottom 0.152: 39.7,32.84 39.7,30.18 39.93,29.95 41.38,29.95 42.37,30.94 R13.1 | 39.7,32.84 39.7,35.43 40.23,35.97 42.6,35.97 Q12.3 | 38.1,32.84 37.34,32.08 36.42,32.08 35.66,31.32 35.66,29.64 33.3,27.28 33.3,25.45 34.67,24.08 34.75,24.08 35.43,23.39 35.43,22.86 36.35,21.95 37.41,21.95 38.1,22.63 41,22.63 RZ2.1 41,22.55 41,20.27 44.27,16.99 v50.14,16.99 | 38.1,32.84 38.1,33.83 37.41,34.52 33.3,34.52 31.17,32.38 JP2.5 | v39.93,32.84 39.7,32.84 | 38.1,32.84 v38.33,32.84 | RN2.3 55.93,25.98 55.93,25.38 53.65,23.09 53.65,22.17 52.12,20.65 U$2.P$11
SDA3V
  Bottom 0.152: J11.3 44.96,44.96 44.96,43.66 42.37,41.07 R14.1 42.29,41 42.29,40.84 40.54,39.09 40.54,36.96 Q12.2 40.46,36.88 39.4,35.81 39.4,31.55 37.41,29.57 36.5,29.57 33.6,26.67 33.6,25.6 34.82,24.38 41,24.38 RZ2.2
THS
  Top 0.152: 38.1,9.14 38.1,24.46 36.88,25.68 U$2.P$26 | 38.1,9.14 38.1,6.93 41.68,3.35 58.83,3.35 61.04,5.56 61.04,6.48 60.81,6.71 60.81,13.34 56.01,18.14 56.01,20.88 RN2.5 | 38.1,9.14 36.35,9.14 34.52,7.32 26.06,7.32 24.61,5.87 12.04,5.87 10.13,7.77 5.03,7.77 3.96,8.84 3.96,38.1 10.97,45.11 10.97,45.95 U1.2
TX
  Bottom 0.152: IC1.1 59.13,48.62 59.13,48.01 57.3,46.18 57.3,37.19 53.65,33.53 53.65,23.55 53.34,23.24 53.34,22.63 52.58,21.87 51.66,21.87 50.9,21.11 50.9,11.66 52.05,10.52 U$2.P$15
V+
  Top 0.61: JP1.1 2.52,6.71 3.28,6.71 7.47,2.52 28.5,2.52 30.48,4.5 V1.IN | D1.C 14.63,29.03 14.63,33.76 12.8,35.59 9.22,35.59 7.47,33.83 7.47,17.14 10.59,14.02 13.95,14.02 J3.3
  Bottom 0.61: J3.3 14.02,13.95 19.2,13.95 20.12,13.03 21.95,13.03 C2.1 22.17,12.8 23.16,11.81 27.43,11.81 28.57,12.95 30.71,12.95 C4.1 31.01,12.95 34.44,9.53 34.44,8.46 30.56,4.57 V1.IN
VCC  (via drill 0.3)
  Top 0.61: J5.2 78.03,3.89 78.03,7.7 78.11,7.77 78.11,9.14 70.56,16.69 62.87,16.69 61.8,17.75 OK1.7 | v54.56,42.98 54.56,33.6 55.93,32.23 55.93,31.09 RN2.1 | v45.49,41.45 51.74,47.7 55.7,47.7 C6.1 56.01,47.7 56.24,47.47 60.35,47.47 61.42,48.54 66.52,48.54 IC1.14 66.83,48.69 70.41,48.69 70.71,49 C7.1 70.64,48.54 70.64,37.49 67.89,34.75 65.91,34.75 65,33.83 65,32.99 58.98,26.98 58.98,26.06 R4.1 | D2.C 25.68,29.03 23.77,30.94 22.94,30.94 21.49,32.38 JP2.1 20.8,32.61 20.8,33.3 18.14,35.97 13.56,35.97 13.26,36.27 13.18,36.27 12.57,36.88 | 12.57,36.88 12.57,46.41 11.05,47.93 11.05,48.54 U1.3 | v26.06,18.9 27.28,18.9 28.96,17.22 35.2,17.22 | 35.2,17.22 35.97,17.22 36.8,18.06 U$2.P$23 | v35.2,13.72 35.2,17.22 | v10.97,8.84 6.71,13.11 6.71,34.21 9.22,36.73 12.34,36.73 12.57,36.88
  Bottom 0.61: C5.1 56.01,15.32 56.69,15.32 59.13,17.75 OK1.8 59.44,17.83 60.12,17.83 | 60.12,17.83 61.72,17.83 OK1.7 | 60.12,17.83 60.12,23.93 58.98,25.07 58.98,25.98 R4.1 | 45.49,32.23 47.47,32.23 48.31,31.39 48.31,31.01 R11.2 | 45.49,32.23 41.53,32.23 40.69,31.39 40.69,31.01 R13.2 | v54.56,42.98 54.56,46.33 55.93,47.7 C6.1 | v45.49,41.45 45.49,32.23 | v26.06,18.9 21.49,23.47 K1.2 | 7.58,4.92 9.98,2.52 35.2,2.52 | 7.58,4.92 5.79,6.71 5.03,6.71 JP1.3 | 35.2,2.52 45.03,2.52 48.46,5.94 J1.5 48.77,5.87 52.12,2.52 76.5,2.52 77.8,3.81 77.95,3.81 J5.2 | 35.2,2.52 v35.2,13.72 | v10.97,8.84 10.97,8.31 7.58,4.92
VCC/2  (via drill 0.3)
  Top 0.61: SV1.2 9.68,16.61 9.68,17.53 8.53,18.67 8.53,20.5 9.68,21.64 SV1.6 | SV1.10 9.68,26.82 9.68,27.66 8.53,28.8 8.53,30.63 9.68,31.77 SV1.14 9.98,32 11.05,33.07 v12.65,33.07 | v19.2,36.04 v25.45,36.04
  Bottom 0.61: JP1.5 7.47,6.78 7.47,7.54 6.25,8.76 6.25,9.75 9.68,13.18 9.68,16.54 SV1.2 | v25.45,36.04 30.33,40.92 36.8,40.92 U$2.P$32 | v19.2,36.04 15.62,36.04 v12.65,33.07 | SV1.6 9.68,21.72 9.68,22.55 8.53,23.7 8.53,25.6 9.68,26.75 SV1.10
VDD  (via drill 0.3)
  Top 0.305: v43.51,40.16 40.16,40.16 36.88,43.43 U$2.P$33
  Bottom 0.305: Q11.1 48.46,36.96 48.46,40.92 48.39,41 R12.2 48.31,41.15 48.31,44.12 46.41,46.02 44.58,46.02 44.04,45.49 44.04,45.11 J11.2 43.97,44.96 43.97,44.5 40.69,41.22 40.69,41.07 R14.2 40.62,41.3 39.01,41.3 36.88,43.43 U$2.P$33 | v43.51,40.16 43.51,35.59 42.98,35.05 40.54,35.05 Q12.1
VIN  (via drill 0.3)
  Top 0.61: v6.02,10.67 8,10.67 12.27,6.4 24.38,6.4 25.83,7.85 34.21,7.85 36.8,10.44 U$2.P$20
  Bottom 0.61: v6.02,10.67 4.65,10.67 3.28,9.3 2.52,9.3 JP1.2
VOUT  (via drill 0.3)
  Top 0.61: JP1.6 7.47,9.3 5.03,9.3 JP1.4 5.26,9.53 v5.26,24 | v11.28,27.81 11.43,27.96 12.8,27.96 13.49,27.28 15.39,27.28 17.07,28.96 22.25,28.96 D1.A
  Bottom 0.61: 22.02,8.31 22.02,8 23.2,6.82 | 22.02,8.31 22.02,8.99 C1.1 | 23.2,6.82 25.45,4.57 V1.OUT | 23.2,6.82 26.52,10.13 27.51,10.13 28.57,9.07 30.71,9.07 C3.1 | v11.28,27.81 10.36,27.81 10.21,27.96 9.22,27.96 v5.26,24 | 22.02,8.31 16.99,8.31 15.7,9.6 7.85,9.6 7.54,9.3 JP1.6

### Text on the board
tNames: 104 | MC1 | USB | 221 | MIDI-OUT | 103 | DS18B20 / or LM35* | 74LS07 | 1S3 | Ichi Kanaya, Ph.D. | SparkFun RTC 12708 | 4.7k | How to make | 1S3 | 1S3 | 221 | 102 | 221 | 473 | 221 | G5V-1 | *Cut this pin | C1815 | 10k | pineapple.cc/card | TLP552 | 105 | 22u | 103 | Arduino Micro | 474 | 104 | 7805 | MIDI-IN | 5V | 9V | MKR | GPIO | SPI | (back) | (back) | (back) | JST-PH | 9V | Pineapple IIc 2.0.7-RC | G | SD | SC | D7 | 5V | G | G1 | G2 | RLY
bNames: 4-M2.6 | Ichi Kanaya / Founder, Pineapple Computer / Founder, TEDxSaikai / Professor, Nagasaki Univ. / https://pineapple.cc/card / kanaya@pineapple.cc, @kanaya | Qwiic/3.3V | JST-SH | MIDI Out | 1: NC | Direct | Bottom View | 2-BSS138 | D12 | 2: GND | 3: NC | A3 | Vcc | GND | NC | SCL | SDA | 4-102 (2012) | 4: Send | Ard. | V/2 | G | D10 | 5: Return | A2 | V/2 | G | Reg. | GND | A1 | D9 | V/2 | G | MIDI In | Dual | 1: NC | A0 | D6 | Danger Zone | 2: NC | V/2 | G | Vcc | 3: NC | 4: Send | Vout | Vin | 5: Return | Vin | Vout | V+ | SPI | 3mm | V+ | V/2 | Vcc | Vout | V+ | Install 3 connectors on this side | JST-PH | JST-PH | JST-PH | MI | MO | SC | Vcc | 89x51mm | 3mm